# Altium schematic sheet IR_array.SchDoc
size A; SheetNumber: 1; SheetTotal: 2; SPICEModelCacheTVPIJQLB: <root> / <DocumentId>TVPIJQLB</DocumentId> / </root>
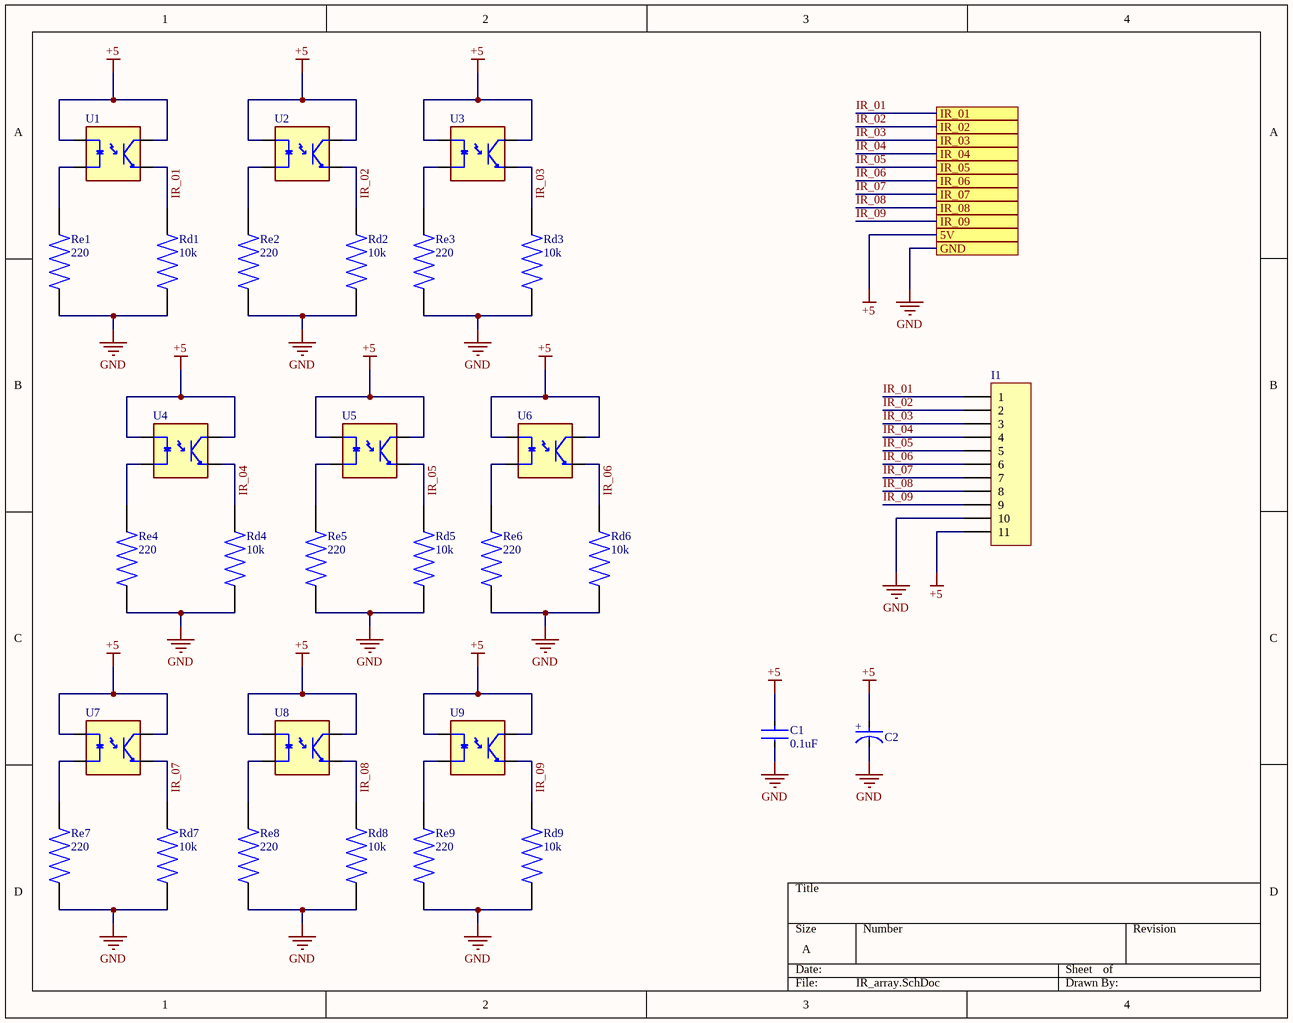
[diagram p0: IR_array.SchDoc]

## Parts
C1  0.1uF  [FP-RDE0P1-MFG]
C2  ECEA1CKA101I  [FP-RAD-TH-D_6_3_0_5-L_7_1-MFG]  (value not drawn)
I1  MHP1x11  [MHPC1x11]  (value not drawn)
Rd1  10k  [RESAD1100W55L680D260]
Rd2  10k  [RESAD1100W55L680D260]
Rd3  10k  [RESAD1100W55L680D260]
Rd4  10k  [RESAD1100W55L680D260]
Rd5  10k  [RESAD1100W55L680D260]
Rd6  10k  [RESAD1100W55L680D260]
Rd7  10k  [RESAD1100W55L680D260]
Rd8  10k  [RESAD1100W55L680D260]
Rd9  10k  [RESAD1100W55L680D260]
Re1  220  [RESAD1100W55L680D260]
Re2  220  [RESAD1100W55L680D260]
Re3  220  [RESAD1100W55L680D260]
Re4  220  [RESAD1100W55L680D260]
Re5  220  [RESAD1100W55L680D260]
Re6  220  [RESAD1100W55L680D260]
Re7  220  [RESAD1100W55L680D260]
Re8  220  [RESAD1100W55L680D260]
Re9  220  [RESAD1100W55L680D260]
U1  TCRT5000  [TCRT5000]  (value not drawn)
U2  TCRT5000  [TCRT5000]  (value not drawn)
U3  TCRT5000  [TCRT5000]  (value not drawn)
U4  TCRT5000  [TCRT5000]  (value not drawn)
U5  TCRT5000  [TCRT5000]  (value not drawn)
U6  TCRT5000  [TCRT5000]  (value not drawn)
U7  TCRT5000  [TCRT5000]  (value not drawn)
U8  TCRT5000  [TCRT5000]  (value not drawn)
U9  TCRT5000  [TCRT5000]  (value not drawn)

## Ports
5V (see MCU[4A]), GND (see MCU[4B]), IR_01 (see MCU[4A]), IR_02 (see MCU[4A]), IR_03 (see MCU[4A]), IR_04 (see MCU[4A]), IR_05 (see MCU[4A]), IR_06 (see MCU[4A]), IR_07 (see MCU[4A]), IR_08 (see MCU[4A]), IR_09 (see MCU[4A])

## Nets
+5: C1.1 C2.2(A) I1.11 U1.A U1.COLL U2.A U2.COLL U3.A U3.COLL U4.A U4.COLL U5.A U5.COLL U6.A U6.COLL U7.A U7.COLL U8.A U8.COLL U9.A U9.COLL ; port 5V
GND: C1.2 C2.1(C) I1.10 Rd1.1 Rd2.1 Rd3.1 Rd4.1 Rd5.1 Rd6.1 Rd7.1 Rd8.1 Rd9.1 Re1.1 Re2.1 Re3.1 Re4.1 Re5.1 Re6.1 Re7.1 Re8.1 Re9.1 ; port GND
IR_01: I1.1 Rd1.2 U1.E ; port IR_01
IR_02: I1.2 Rd2.2 U2.E ; port IR_02
IR_03: I1.3 Rd3.2 U3.E ; port IR_03
IR_04: I1.4 Rd4.2 U4.E ; port IR_04
IR_05: I1.5 Rd5.2 U5.E ; port IR_05
IR_06: I1.6 Rd6.2 U6.E ; port IR_06
IR_07: I1.7 Rd7.2 U7.E ; port IR_07
IR_08: I1.8 Rd8.2 U8.E ; port IR_08
IR_09: I1.9 Rd9.2 U9.E ; port IR_09
NetRe1_2: Re1.2 U1.CATH
NetRe2_2: Re2.2 U2.CATH
NetRe3_2: Re3.2 U3.CATH
NetRe4_2: Re4.2 U4.CATH
NetRe5_2: Re5.2 U5.CATH
NetRe6_2: Re6.2 U6.CATH
NetRe7_2: Re7.2 U7.CATH
NetRe8_2: Re8.2 U8.CATH
NetRe9_2: Re9.2 U9.CATH

## Notes on the sheet
- (in symbol CMP-05427-001316-1) +

## Library data of the parts
C1 = CMP-06035-046728-1: Ceramic Capacitor 100nF ±10% 25V X7R Radial; Lead Diameter: 0.5mm; Termination: Radial; Min Operating Temperature: -55°C; Max Operating Temperature: 125°C; Height: 3.5mm; Mount: Through Hole; Voltage Rating (DC): 25V; Width: 3.5mm; Dielectric: X7R; Height - Seated (Max): 0.236inch; Voltage Rating: 25V; Length: 0.197inch; Lead Free: Lead Free; Lead Pitch: 0.098inch; Case/Package: Radial; Tolerance: 10%; Packaging: Tape and Reel; Capacitance: 100nF; Resistor Type: Ceramic; Package Quantity: 2000
C2 = CMP-05427-001316-1: Aluminum Electrolytic Capacitors (Radial Lead Type) 100uF ±20% 16V; Life (Hours): 1000Hour; Lead Diameter: 0.45mm; Polarity: Polar; Ripple Current: 91mA; Series: KA; Packaging: Tape and Reel; Voltage Rating: 16V; Voltage Rating (DC): 16V; Min Operating Temperature: -40°C; Lead Pitch: 2.5mm; Mount: Through Hole; Height - Seated (Max): 0.315inch; Package Quantity: 2000; Length: 7mm; Termination: Radial; Voltage: 16V; Diameter: 6.3mm; Height: 7mm; Radiation Hardening: No; RoHS Compliant: Yes; Tolerance: 20%; Capacitance: 100uF; Case/Package: Radial; Max Operating Temperature: 85°C
Rd1-Rd9 Re1-Re9 = MFR-25FBF52-1K: 1.07 kOhms Â±1% 0.25W, 1/4W Through Hole Resistor Axial - Metal Film; MF: Yageo; Value: *; SnapEDA_Link: https://www.snapeda.com/parts/MFR-25FBF52-1K/Yageo/view-part/?ref=snap; Purchase-URL: https://pricing.snapeda.com/search/part/MFR-25FBF52-1K/?ref=eda; Availability: In Stock; Price: None; Package: Axial Yageo; Check_prices: https://www.snapeda.com/parts/MFR-25FBF52-1K/Yageo/view-part/?ref=eda; MP: MFR-25FBF52-1K
U1-U9 = TCRT5000: 950 nm 60 mA Through Hole Reflective Optical Sensor with Transistor Output; Availability: Unavailable; MP: TCRT5000; Value: *; Price: None; Package: None